# Altium schematic sheet Sheet1.SchDoc
size A; SheetNumber: 1; SheetTotal: 1
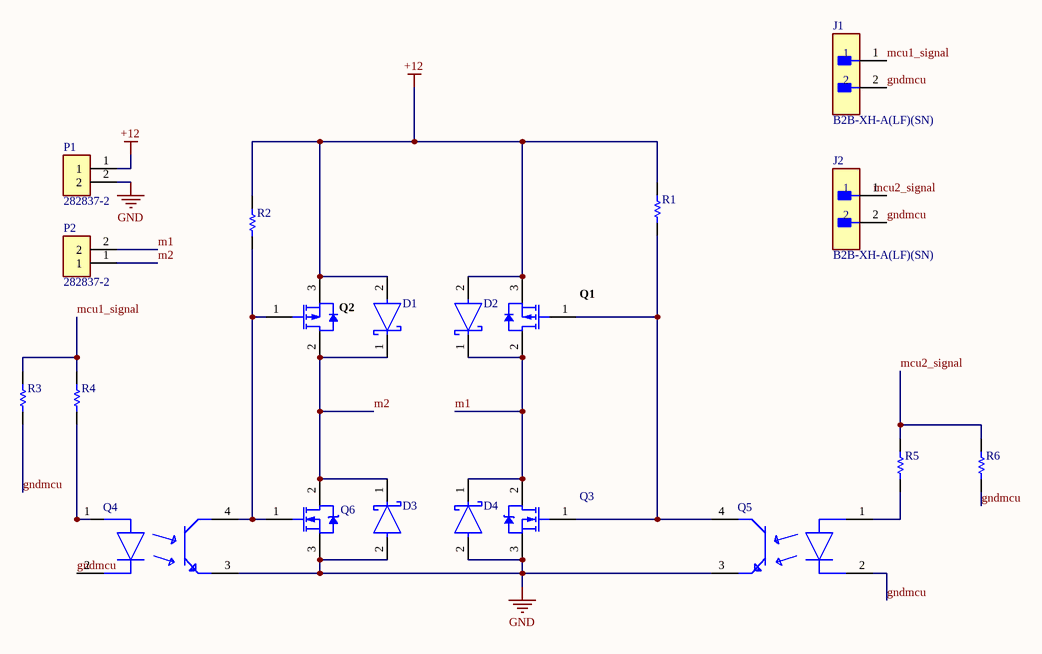
[diagram p0: Sheet1.SchDoc]

## Parts
D1  1N5822-E3/54  [FP-1N5822-E3-54-MFG]  (value not drawn)
D2  1N5822-E3/54  [FP-1N5822-E3-54-MFG]  (value not drawn)
D3  1N5822-E3/54  [FP-1N5822-E3-54-MFG]  (value not drawn)
D4  1N5822-E3/54  [FP-1N5822-E3-54-MFG]  (value not drawn)
J1  B2B-XH-A(LF)(SN)  [FP-B2B-XH-A_LF_SN-MFG]
J2  B2B-XH-A(LF)(SN)  [FP-B2B-XH-A_LF_SN-MFG]
P1  282837-2  [TE_282837-2]
P2  282837-2  [TE_282837-2]
Q1  FQP27P06  [FAIR-TO-220-3]  (value not drawn)
Q2  FQP27P06  [FAIR-TO-220-3]  (value not drawn)
Q3  IRLB3034PBF  [INF-PG-TO-220AB]  (value not drawn)
Q4  PC817X4NIP0F  [FP-PC817X4NIP0F-MFG]  (value not drawn)
Q5  PC817X4NIP0F  [FP-PC817X4NIP0F-MFG]  (value not drawn)
Q6  IRLB3034PBF  [INF-PG-TO-220AB]  (value not drawn)
R1  MFR-25FBF5210K  [RESA60-630X240]  (value not drawn)
R2  MFR-25FBF5210K  [RESA60-630X240]  (value not drawn)
R3  MFR-25FBF5210K  [RESA60-630X240]  (value not drawn)
R4  MFR-25FBF52470Ohm  [RESA60-630X240]  (value not drawn)
R5  MFR-25FBF52470Ohm  [RESA60-630X240]  (value not drawn)
R6  MFR-25FBF5210K  [RESA60-630X240]  (value not drawn)

## Nets
+12: D1.2(A) D2.2(A) P1.1 Q1.3(S) Q2.3(S) R1.2 R2.2
GND: D3.2(A) D4.2(A) P1.2 Q3.3(S) Q4.3(E) Q5.3(E) Q6.3(S)
gndmcu: J1.2 J2.2 Q4.2(C) Q5.2(C) R3.1 R6.1
m1: D2.1(C) D4.1(C) P2.2 Q1.2(D) Q3.2(D)
m2: D1.1(C) D3.1(C) P2.1 Q2.2(D) Q6.2(D)
mcu1_signal: J1.1 R3.2 R4.2
mcu2_signal: R5.2 R6.2
NetQ1_1: Q1.1(G) Q3.1(G) Q5.4(C) R1.1
NetQ2_1: Q2.1(G) Q4.4(C) Q6.1(G) R2.1
NetQ4_1: Q4.1(A) R4.1
NetQ5_1: Q5.1(A) R5.1

Not connected (* = marked no-connect by the designer): J2 1

## Notes on the sheet
- Labels drawn without touching a wire or pin: mcu2_signal

## Library data of the parts
D1-D4 = CMP-02539-000009-1: DIODE SCHOTTKY 40V 3A DO201AD; Manufacturer: Vishay; Max Surge Forward Current: 80A; Peak Reverse Current: 2mA; Max Junction Temp: +125°C; Package: 0; Automotive: No; Device Class L1: Discrete Semiconductors; Lead Free: Yes; Forward Current: 3A; Digikey Description: DIODE SCHOTTKY 40V 3A DO201AD; Manufacturer Part Number: 1N5822-E3/54; Temperature Range High: +125°C; ComponentLink2Description: Datasheet; Mouser Description: Schottky Diodes & Rectifiers Vr/40V Io/3A; Max Repetitive Reverse Voltage: 40V; Device Class L2: Diodes; Temperature: -65°C to +125°C; Octopart: https://octopart.com/1n5822-e3%2F54-vishay-39548309; Temperature Range Low: -65°C; Reverse Voltage: 40V; Height: 5.3mm; Category: Diode; Device Class L3: Schottky Diodes; RoHS: TRUE; ComponentLink2URL: http://www.vishay.com/docs/88526/1n5820.pdf; Ipc Land Pattern Name: DIOPA2112W150L950D530
J1 J2 = CMP-2000-05888-3: CONN HEADER VERT 2POS 2.5MM; Current Rating: 3A; Voltage Rating: 250V; Number of Contacts: 2; Contact Resistance: 20mR; Wire/Cable Gauge: 22AWG; Insulation Resistance: 1GR; Connector Type: Male Pin; Packaging: Bulk; Contact Material: Brass; Lead Free: Lead Free; Orientation: Straight; Contact Plating: Tin; Max Current Rating: 3A; Termination: Solder; Fastening Type: Detent; Depth: 5.75mm; Housing Material: Polyamide; REACH SVHC: No SVHC; Series: XH; Voltage Rating (AC): 250V; Number of Positions: 2; Color: Natural; Contact Type: Male Pin; Max Voltage Rating (DC): 250V; Pitch: 2.5mm; Lead Pitch: 2.5mm; Mount: Through Hole; Max Operating Temperature: 85°C; Length: 7.4mm; Max Voltage Rating (AC): 250V; Min Operating Temperature: -25°C; Number of Rows: 1; Housing Color: White
P1 P2 = 282837-2: Ð Ð°Ð·ÑŠÐµÐ¼Ð½Ñ‹Ðµ ÐºÐ»ÐµÐ¼Ð¼Ð½Ñ‹Ðµ ÐºÐ¾Ð»Ð¾Ð´ÐºÐ¸ Ð Ð¾Ð·ÐµÑ‚ÐºÐ° 2 Ð¿Ð¾Ð»Ð¾Ð¶ÐµÐ½Ð¸Ñ 5,08 Ð¼Ð¼ ÐŸÑ€Ð¸Ð¿Ð¾Ð¹ Ð¿Ñ€ÑÐ¼Ð¾Ð¹ Ñ‡ÐµÑ€ÐµÐ· Ð¾Ñ‚Ð²ÐµÑ€ÑÑ‚Ð¸Ðµ 13,5 Ð / ÐºÐ¾Ð½Ñ‚Ð°ÐºÑ‚; MF: TE Connectivity; SnapEDA_Link: https://www.snapeda.com/parts/282837-2/TE+Connectivity+AMP+Connectors/view-part/?ref=snap; Price: None; Check_prices: https://www.snapeda.com/parts/282837-2/TE+Connectivity+AMP+Connectors/view-part/?ref=eda; Purchase-URL: https://pricing.snapeda.com/search/part/282837-2/?ref=eda; MP: 282837-2; Value: *; Availability: In Stock; Package: None
Q1 Q2 = CMP-2000-04936-1: P-Channel QFET(R) MOSFET, -60 V, -27 A, -55 to 175 degC, 3-Pin TO-220, RoHS, Tube; Manufacturer: Fairchild; Rated Power Dissipation: 120W; Qg Gate Charge: 33nC; Drain-Source On Resistance-Max: 0.07O; Drain-to-Source Voltage [Vdss]: 60V; Package Reference: TO-220; Datasheet URL: https://www.fairchildsemi.com/datasheets/FQ/FQP27P06.pdf; Datasheet Version: Mar-13; Package Description: 3-Pin Through Hole Device, Body 10 x 4.5 mm, Pitch 2.54 mm; Package URL: https://www.fairchildsemi.com/package-drawings/TO/TO220B03.pdf; Channel Type: P-Channel; Manufacturer URL: https://www.fairchildsemi.com/
Q3 Q6 = CMP-2000-04998-1: Mosfet N-Channel, 40 V, 195 A, -55 to 175 degC, 3-Pin TO-220AB, RoHS, Tube; Manufacturer: International Rectifier; Typical TurnOff Delay Time: 97ns; Configuration: Single; Maximum Continuous Drain Current: 343A; Typical Input Capacitance @ Vds: 10315pF@25V; Maximum Power Dissipation: 375W; Maximum Gate Source Voltage: ±20V; Forward Diode Voltage: 1.3V; Maximum Drain Source Voltage: 40V; Typical Turn On Delay Time: 65ns; Maximum Drain Source Resistance: 2mΩ; Package Version: Feb-04; Channel Type: N; Channel Mode: Enhancement; Typical Gate Charge @ Vgs: 54nC@4.5V; Number of Elements per Chip: 1; Forward Transconductance: 286S; Datasheet URL: https://datasheet.ciiva.com/26325/161162-da-01-en-mosfet-irlb3034pbf-to220ab-ir-26325354.pdf; Series: HEXFETSeries; Datasheet Version: Jan-09; Pin Count: 3; Manufacturer URL: http://internationalrectifier.com/; Maximum Operating Temperature: +175degC; Operating Temperature Range: -55to+175degC; Height: 15.24mm; Mounting Type: ThroughHole; Dimensions: 10.54x4.69x15.24mm; Package Reference: PG-TO-220AB; Package Description: 3-Pin Plastic (Green) Transistor Single Outline Package, 9.9 x 9.2 mm Body, 2.54 mm Pitch; Category: PowerMOSFET; Length: 10.54mm; Package URL: http://www.infineon.com/dgdl/bts110.pdf?folderId=db3a304412b407950112b43583c16310&fileId=db3a304412b407950112b43584326311&sId=db3a30443e3c704d013e4eb6657a2604; Package Type: TO-220AB; Width: 4.69mm; Minimum Operating Temperature: -55degC
Q4 Q5 = CMP-65434-000001-1: OPTOISOLATOR 5KV TRANS 4SMD; Manufacturer: Sharp; Collector Emitter Voltage: 80V; Standoff Height: 0.1mm; Power Dissipation: 200mW; Min Current Transfer Ratio: 50%; Description: Optocoupler DC-IN 1-CH Transistor DC-OUT 4-Pin PDIP SMD; Reverse Voltage: 6V; Forward Current: 20mA; Forward Voltage: 1.2V; Max Current Transfer Ratio: 600%; Isolation Voltage: 5kVrms; Mouser Description: Transistor Output Optocouplers Photocoupler 300-600% CRT; RoHS: TRUE; ComponentLink2URL: https://www.sharpsde.com/fileadmin/products/Optoelectronics/Isolation%20Devices/Specs%20Photocoupler/PC817XxNIP0F_17Jun08_Spec_ED-04P129A.pdf; Lead Free: Yes; Device Class L1: Optoelectronics; ComponentLink2Description: Datasheet; Device Class L2: Optocouplers; Temperature: -30°C to +100°C; Temperature Range Low: -30°C; Automotive: No; Temperature Range High: +100°C; Octopart: https://octopart.com/pc817x4nip0f-sharp-20650453; Height: 4.6mm; Digikey Description: OPTOISOLATOR 5KV TRANS 4SMD; Category: Trans; Device Class L3: unset; Package: PC817X4NIP0F; Manufacturer Part Number: PC817X4NIP0F; Emiiter Collector Voltage: 6V
R1-R3 R6 = CMP-1659-00074-2: Axial Resistor, 10 KOhm, +/- 1%, 0.25 W, -55 to 155 degC, 2-Pin THD, RoHS, Bulk; Manufacturer: Yageo; Temperature Coefficient: 100ppm\/degreesC; Voltage Rating: 250V; Voltage Rating (DC): 200V; Resistance: 10KOhm; Max Power Dissipation: 250mW; Datasheet URL: http://www.yageo.com/documents/recent/Yageo%20LR_MFR_2013.pdf; Packaging: Bulk; RoHSCompliant: True; Mount: ThroughHole; Package Reference: MFR-25; Termination: Axial; Composition: MetalFilm; Number of Terminations: 2; Package Quantity: 200; Mounting Technology: ThroughHole; Length: 0.248inch; Max Operating Temperature: 155degC; Min Operating Temperature: -55degC; Datasheet Version: 04/2013; Lead Free: LeadFree; Manufacturer URL: http://www.yageo.com/; Tolerance: 1%; Power Rating: 250mW; Package Description: 2-Pin Axial Lead, Dia 2.4 mm, Body Length 6.3 mm; Military Standard: Not; Case\/Package: Axial
R4 R5 = CMP-1659-00074-2: Axial Resistor, 470 Ohm, +/- 1%, 0.25 W, -55 to 155 degC, 2-Pin THD, RoHS, Bulk; Manufacturer: Yageo; Temperature Coefficient: 100ppm\/degreesC; Voltage Rating: 250V; Voltage Rating (DC): 200V; Resistance: 10KOhm; Max Power Dissipation: 250mW; Datasheet URL: http://www.yageo.com/documents/recent/Yageo%20LR_MFR_2013.pdf; Packaging: Bulk; RoHSCompliant: True; Mount: ThroughHole; Package Reference: MFR-25; Termination: Axial; Composition: MetalFilm; Number of Terminations: 2; Package Quantity: 200; Mounting Technology: ThroughHole; Length: 0.248inch; Max Operating Temperature: 155degC; Min Operating Temperature: -55degC; Datasheet Version: 04/2013; Lead Free: LeadFree; Manufacturer URL: http://www.yageo.com/; Tolerance: 1%; Power Rating: 250mW; Package Description: 2-Pin Axial Lead, Dia 2.4 mm, Body Length 6.3 mm; Military Standard: Not; Case\/Package: Axial